# EAGLE design main_controller_board (EAGLE 7.5.0)

## Sheet 1 of 2
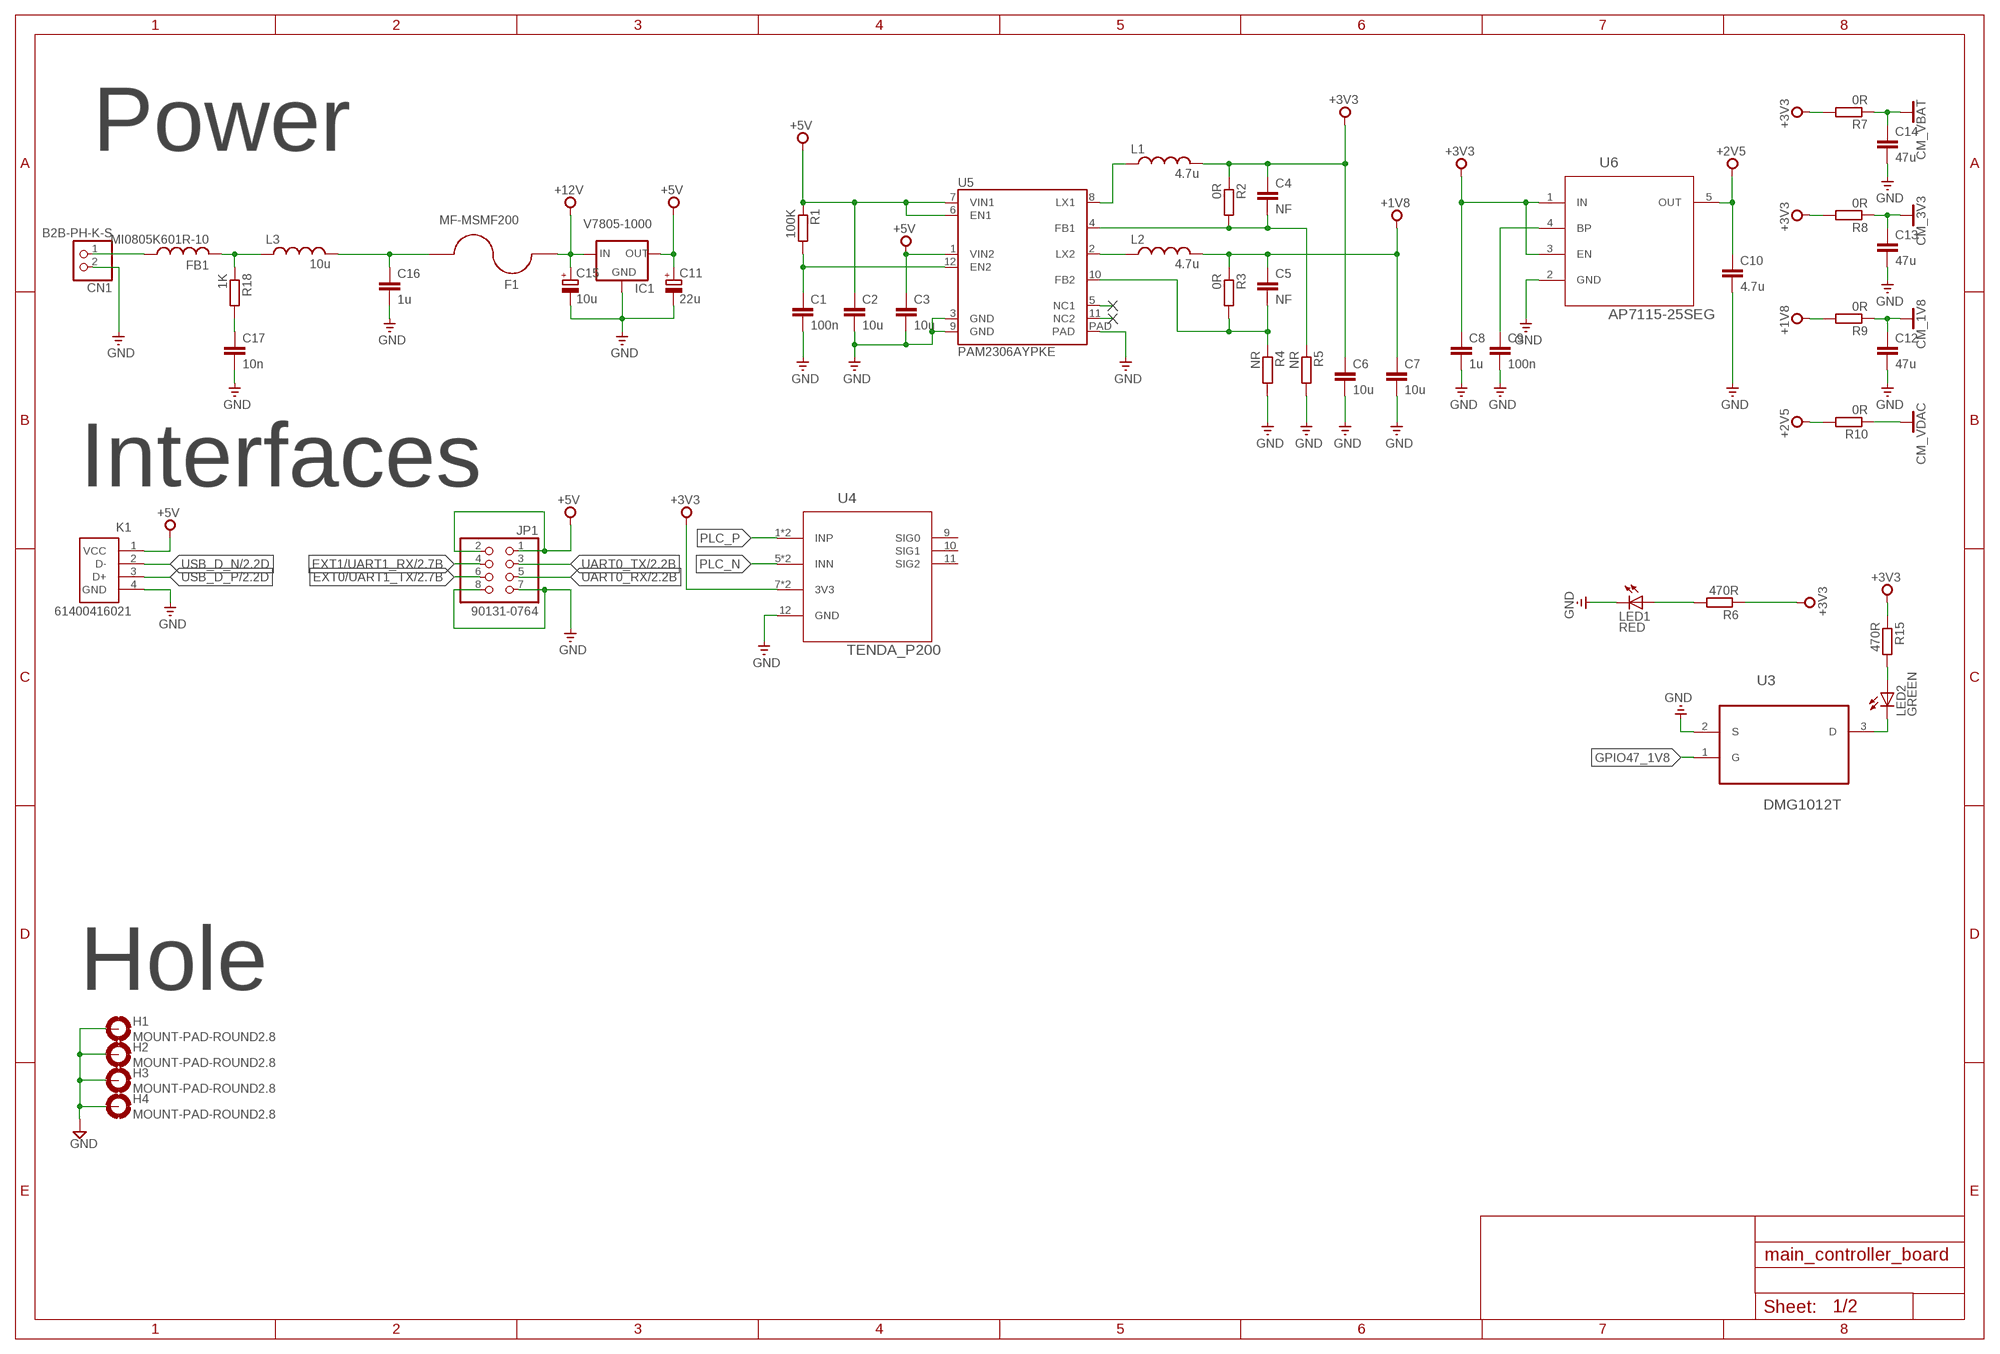
[diagram p0: schematic, sheet 1]

### Parts
C1  100n  C-EUC0402  [C0402]
C2  10u  C-EUC0805  [C0805]
C3  10u  C-EUC0805  [C0805]
C4  NF  C-EUC0402  [C0402]
C5  NF  C-EUC0402  [C0402]
C6  10u  C-EUC0805  [C0805]
C7  10u  C-EUC0805  [C0805]
C8  1u  C-EUC0402  [C0402]
C9  100n  C-EUC0402  [C0402]
C10  4.7u  C-EUC0603  [C0603]
C11  22u  CPOL-EU153CLV-0405  [153CLV-0405]
C12  47u  C-EUC1206  [C1206]
C13  47u  C-EUC1206  [C1206]
C14  47u  C-EUC1206  [C1206]
C15  10u  CPOL-EU153CLV-0405  [153CLV-0405]
C16  1u  C-EUC0402  [C0402]
C17  10n  C-EUC0402  [C0402]
CN1  B2B-PH-K-S  JST_2PIN-THM  [JST-PH-2-THM]
F1  MF-MSMF200  MF-MSMF075/24  [1812]
FB1  MI0805K601R-10  FERRITESIZE_0805  [R0805]
H1  MOUNT-PAD-ROUND2.8  [2,8-PAD]
H2  MOUNT-PAD-ROUND2.8  [2,8-PAD]
H3  MOUNT-PAD-ROUND2.8  [2,8-PAD]
H4  MOUNT-PAD-ROUND2.8  [2,8-PAD]
IC1  V7805-1000  VR_1OUTXX  [DIP_3PIN]
JP1  90131-0764  PINHD-2X4  [2X04]
K1  61400416021  [61400416021]
L1  4.7u  BOURNS-SRN4018  [BOURNS-SRN4018]
L2  4.7u  BOURNS-SRN4018  [BOURNS-SRN4018]
L3  10u  BOURNS-SRN4018  [BOURNS-SRN4018]
LED1  RED  LEDCHIP-LED0603  [CHIP-LED0603]
LED2  GREEN  LEDCHIP-LED0603  [CHIP-LED0603]
R1  100K  R-EU_R0402  [R0402]
R2  0R  R-EU_R0402  [R0402]
R3  0R  R-EU_R0402  [R0402]
R4  NR  R-EU_R0402  [R0402]
R5  NR  R-EU_R0402  [R0402]
R6  470R  R-EU_R0402  [R0402]
R7  0R  R-EU_R0805  [R0805]
R8  0R  R-EU_R0805  [R0805]
R9  0R  R-EU_R0805  [R0805]
R10  0R  R-EU_R0805  [R0805]
R15  470R  R-EU_R0402  [R0402]
R18  1K  R-EU_R0402  [R0402]
U3  DMG1012T  [SOT523]
U4  TENDA_P200  [TENDA_P200]
U5  PAM2306AYPKE  PAM2306  [WDFN3X3-12L]
U6  AP7115-25SEG  AP7115-XXSEG  [SOT353]

### Nets
+1V8: C5.1 C7.1 L2.P$1 R3.1 R9.2
+2V5: C10.1 R10.2 U6.5(OUT)
+3V3: C4.1 C6.1 C8.1 L1.P$1 R2.1 R6.1 R7.2 R8.2 R15.1 U4.7(3V3) U4.8(3V3) U6.1(IN) U6.3(EN) ; also sheet 2
+5V: C2.1 C3.1 C11.+ IC1.OUT JP1.1 JP1.2 K1.1(VCC) R1.1 U5.1(VIN2) U5.6(EN1) U5.7(VIN1)
+12V: C15.+ F1.2 IC1.IN
CM_1V8: C12.1 R9.1 ; also sheet 2
CM_3V3: C13.1 R8.1 ; also sheet 2
CM_VBAT: C14.1 R7.1 ; also sheet 2
CM_VDAC: R10.1 ; also sheet 2
EXT0/UART1_TX: JP1.6 ; also sheet 2
EXT1/UART1_RX: JP1.4 ; also sheet 2
GND [GND]: C1.2 C2.2 C3.2 C6.2 C7.2 C8.2 C9.2 C10.2 C11.- C12.2 C13.2 C14.2 C15.- C16.2 C17.2 CN1.2 H1.B2,8(MOUNT) H2.B2,8(MOUNT) H3.B2,8(MOUNT) H4.B2,8(MOUNT) IC1.GND JP1.7 JP1.8 K1.4(GND) LED1.C R4.2 R5.2 U3.2(S) U4.12(GND) U5.3(GND) U5.9(GND) U5.PAD U6.2(GND) ; also sheet 2
GPIO47_1V8: U3.1(G) ; also sheet 2
N$1: C1.1 R1.2 U5.12(EN2)
N$2: L1.P$2 U5.8(LX1)
N$3: U5.5(NC1)
N$4: U5.11(NC2)
N$5: C9.1 U6.4(BP)
N$6: FB1.2 L3.P$2 R18.1
N$7: L2.P$2 U5.2(LX2)
N$8: C4.2 R2.2 R5.1 U5.4(FB1)
N$9: LED1.A R6.2
N$10: C5.2 R3.2 R4.1 U5.10(FB2)
N$32: LED2.A R15.2
N$33: LED2.C U3.3(D)
N$36: CN1.1 FB1.1
N$37: C16.1 F1.1 L3.P$1
N$38: C17.1 R18.2
PLC_N [100ohm_differencial_pair]: U4.5(INN) U4.6(INN)
PLC_P [100ohm_differencial_pair]: U4.1(INP) U4.2(INP)
UART0_RX: JP1.5 ; also sheet 2
UART0_TX: JP1.3 ; also sheet 2
USB_D_N [90ohm_differencial_pair]: K1.2(D-) ; also sheet 2
USB_D_P [90ohm_differencial_pair]: K1.3(D+) ; also sheet 2
Unconnected: U4.9(SIG0) U4.10(SIG1) U4.11(SIG2)

### Notes on the sheet
- Power
- Interfaces
- Hole

## Sheet 2 of 2
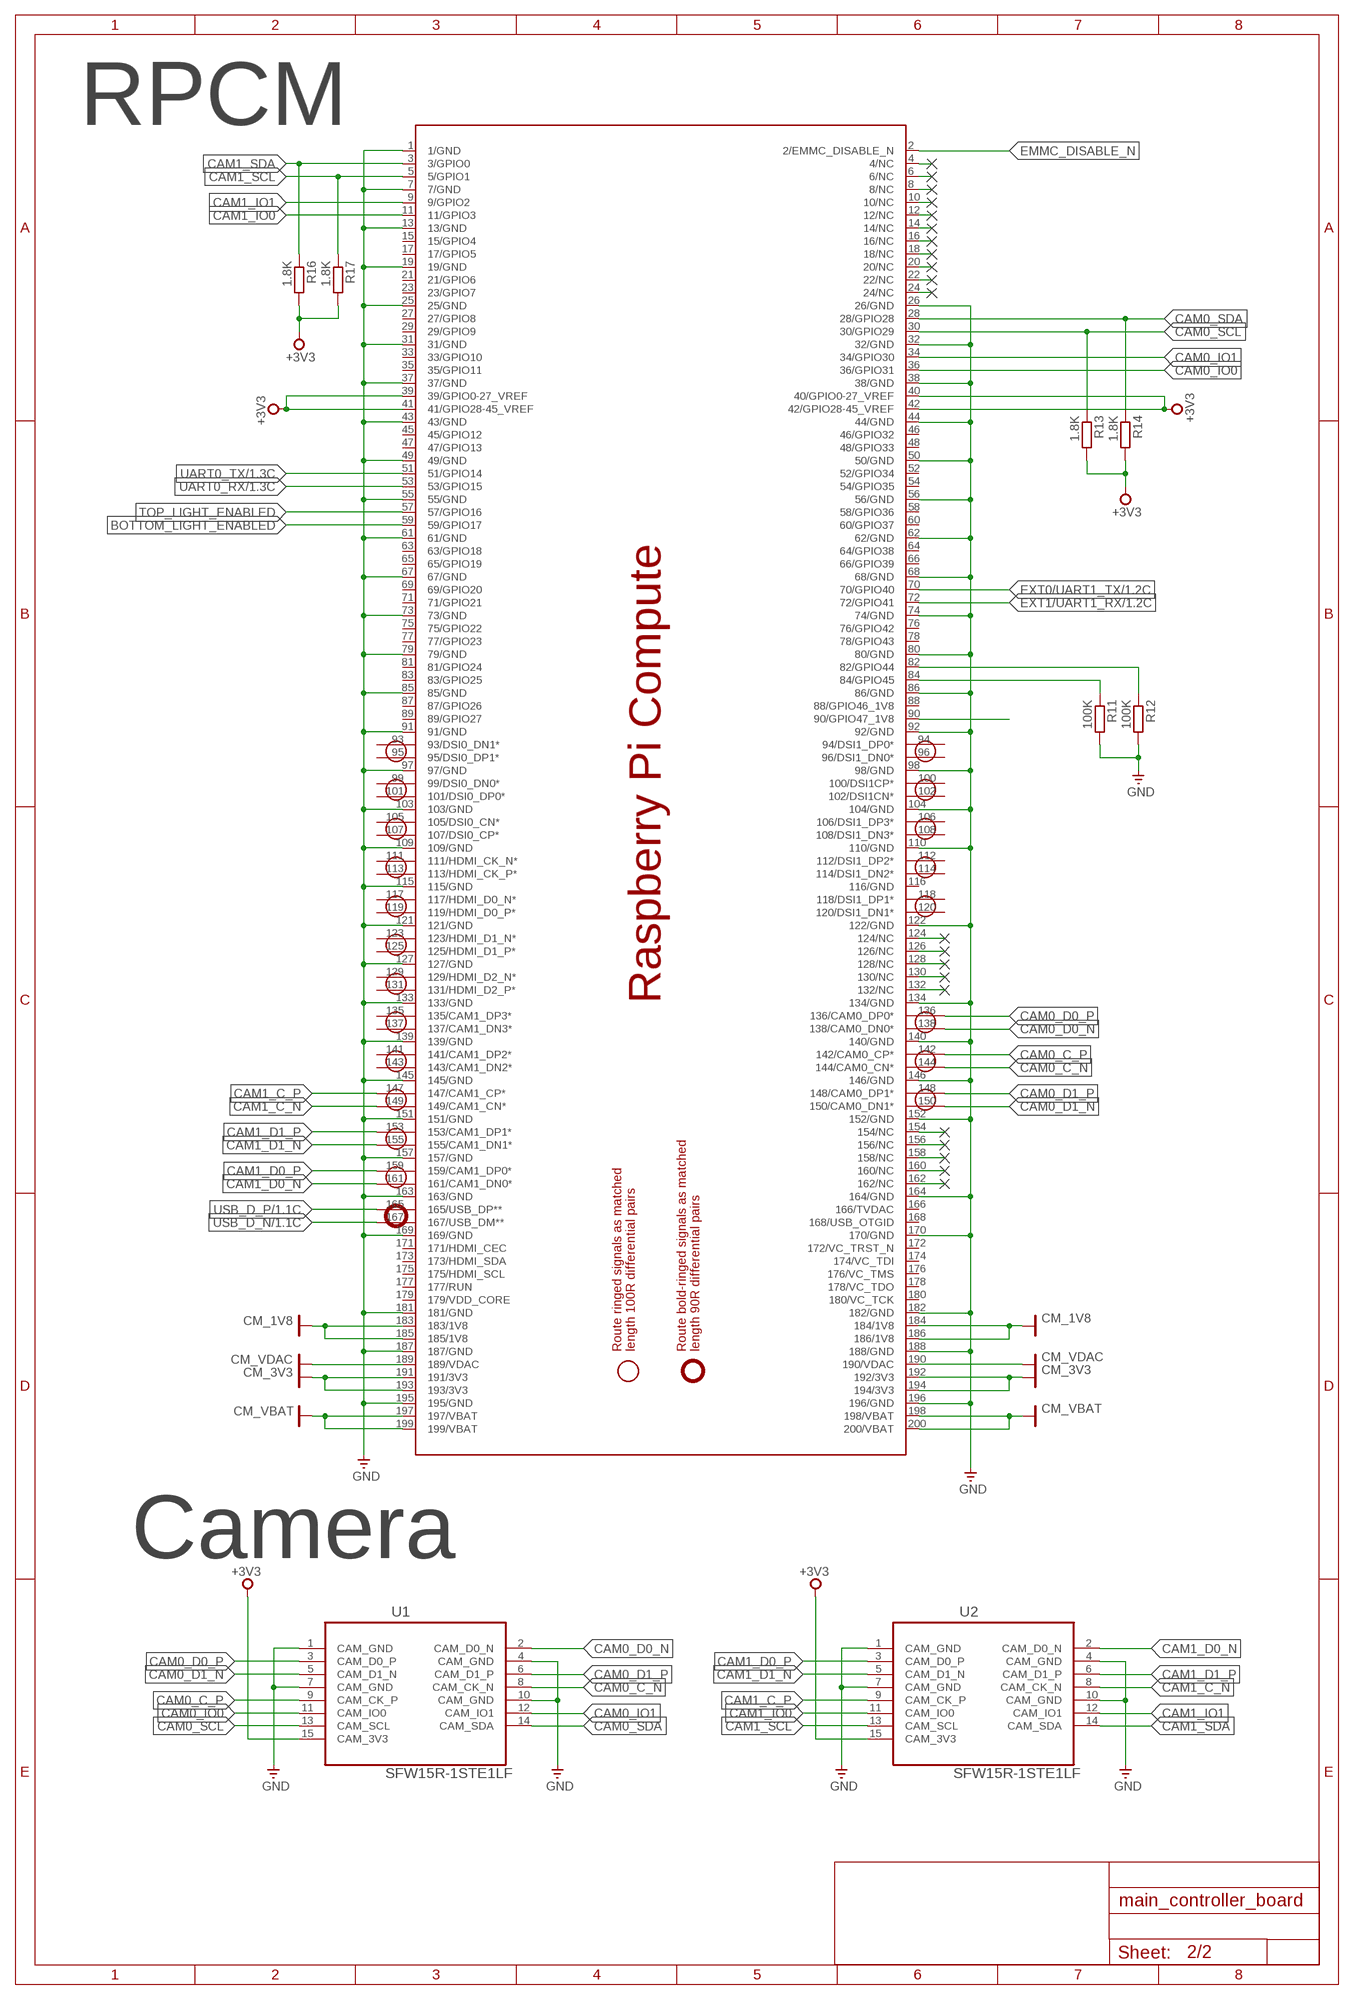
[diagram p1: schematic, sheet 2]

### Parts
PCB1  1473005-4  RPI_COMPUTE  [RPI_COMPUTE]
R11  100K  R-EU_R0402  [R0402]
R12  100K  R-EU_R0402  [R0402]
R13  1.8K  R-EU_R0402  [R0402]
R14  1.8K  R-EU_R0402  [R0402]
R16  1.8K  R-EU_R0402  [R0402]
R17  1.8K  R-EU_R0402  [R0402]
U1  SFW15R-1STE1LF  RPI_CAMERA  [RPI_CAMERA]
U2  SFW15R-1STE1LF  RPI_CAMERA  [RPI_CAMERA]

### Nets
+3V3: PCB1.39(39/GPIO0-27_VREF) PCB1.40(40/GPIO0-27_VREF) PCB1.41(41/GPIO28-45_VREF) PCB1.42(42/GPIO28-45_VREF) R13.2 R14.2 R16.2 R17.2 U1.15(CAM_3V3) U2.15(CAM_3V3) ; also sheet 1
BOTTOM_LIGHT_ENABLED: PCB1.59(59/GPIO17)
CAM0_C_N [100ohm_differencial_pair]: PCB1.144(144/CAM0_CN*) U1.8(CAM_CK_N)
CAM0_C_P [100ohm_differencial_pair]: PCB1.142(142/CAM0_CP*) U1.9(CAM_CK_P)
CAM0_D0_N [100ohm_differencial_pair]: PCB1.138(138/CAM0_DN0*) U1.2(CAM_D0_N)
CAM0_D0_P [100ohm_differencial_pair]: PCB1.136(136/CAM0_DP0*) U1.3(CAM_D0_P)
CAM0_D1_N [100ohm_differencial_pair]: PCB1.150(150/CAM0_DN1*) U1.5(CAM_D1_N)
CAM0_D1_P [100ohm_differencial_pair]: PCB1.148(148/CAM0_DP1*) U1.6(CAM_D1_P)
CAM0_IO0: PCB1.36(36/GPIO31) U1.11(CAM_IO0)
CAM0_IO1: PCB1.34(34/GPIO30) U1.12(CAM_IO1)
CAM0_SCL: PCB1.30(30/GPIO29) R13.1 U1.13(CAM_SCL)
CAM0_SDA: PCB1.28(28/GPIO28) R14.1 U1.14(CAM_SDA)
CAM1_C_N [100ohm_differencial_pair]: PCB1.149(149/CAM1_CN*) U2.8(CAM_CK_N)
CAM1_C_P [100ohm_differencial_pair]: PCB1.147(147/CAM1_CP*) U2.9(CAM_CK_P)
CAM1_D0_N [100ohm_differencial_pair]: PCB1.161(161/CAM1_DN0*) U2.2(CAM_D0_N)
CAM1_D0_P [100ohm_differencial_pair]: PCB1.159(159/CAM1_DP0*) U2.3(CAM_D0_P)
CAM1_D1_N [100ohm_differencial_pair]: PCB1.155(155/CAM1_DN1*) U2.5(CAM_D1_N)
CAM1_D1_P [100ohm_differencial_pair]: PCB1.153(153/CAM1_DP1*) U2.6(CAM_D1_P)
CAM1_IO0: PCB1.11(11/GPIO3) U2.11(CAM_IO0)
CAM1_IO1: PCB1.9(9/GPIO2) U2.12(CAM_IO1)
CAM1_SCL: PCB1.5(5/GPIO1) R17.1 U2.13(CAM_SCL)
CAM1_SDA: PCB1.3(3/GPIO0) R16.1 U2.14(CAM_SDA)
CM_1V8: PCB1.183(183/1V8) PCB1.184(184/1V8) PCB1.185(185/1V8) PCB1.186(186/1V8) ; also sheet 1
CM_3V3: PCB1.191(191/3V3) PCB1.192(192/3V3) PCB1.193(193/3V3) PCB1.194(194/3V3) ; also sheet 1
CM_VBAT: PCB1.197(197/VBAT) PCB1.198(198/VBAT) PCB1.199(199/VBAT) PCB1.200(200/VBAT) ; also sheet 1
CM_VDAC: PCB1.189(189/VDAC) PCB1.190(190/VDAC) ; also sheet 1
EMMC_DISABLE_N: PCB1.2(2/EMMC_DISABLE_N)
EXT0/UART1_TX: PCB1.70(70/GPIO40) ; also sheet 1
EXT1/UART1_RX: PCB1.72(72/GPIO41) ; also sheet 1
GND [GND]: PCB1.1(1/GND) PCB1.7(7/GND) PCB1.13(13/GND) PCB1.19(19/GND) PCB1.25(25/GND) PCB1.26(26/GND) PCB1.31(31/GND) PCB1.32(32/GND) PCB1.37(37/GND) PCB1.38(38/GND) PCB1.43(43/GND) PCB1.44(44/GND) PCB1.49(49/GND) PCB1.50(50/GND) PCB1.55(55/GND) PCB1.56(56/GND) PCB1.61(61/GND) PCB1.62(62/GND) PCB1.67(67/GND) PCB1.68(68/GND) PCB1.73(73/GND) PCB1.74(74/GND) PCB1.79(79/GND) PCB1.80(80/GND) PCB1.85(85/GND) PCB1.86(86/GND) PCB1.91(91/GND) PCB1.92(92/GND) PCB1.97(97/GND) PCB1.98(98/GND) PCB1.103(103/GND) PCB1.104(104/GND) PCB1.109(109/GND) PCB1.110(110/GND) PCB1.115(115/GND) PCB1.121(121/GND) PCB1.122(122/GND) PCB1.127(127/GND) PCB1.133(133/GND) PCB1.134(134/GND) PCB1.139(139/GND) PCB1.140(140/GND) PCB1.145(145/GND) PCB1.146(146/GND) PCB1.151(151/GND) PCB1.152(152/GND) PCB1.157(157/GND) PCB1.163(163/GND) PCB1.164(164/GND) PCB1.169(169/GND) PCB1.170(170/GND) PCB1.181(181/GND) PCB1.182(182/GND) PCB1.187(187/GND) PCB1.188(188/GND) PCB1.195(195/GND) PCB1.196(196/GND) R11.2 R12.2 U1.1(CAM_GND) U1.4(CAM_GND) U1.7(CAM_GND) U1.10(CAM_GND) U2.1(CAM_GND) U2.4(CAM_GND) U2.7(CAM_GND) U2.10(CAM_GND) ; also sheet 1
GPIO47_1V8: PCB1.90(90/GPIO47_1V8) ; also sheet 1
N$11: PCB1.154(154/NC)
N$12: PCB1.156(156/NC)
N$13: PCB1.158(158/NC)
N$14: PCB1.160(160/NC)
N$15: PCB1.162(162/NC)
N$16: PCB1.10(10/NC)
N$17: PCB1.12(12/NC)
N$18: PCB1.14(14/NC)
N$19: PCB1.16(16/NC)
N$20: PCB1.18(18/NC)
N$21: PCB1.20(20/NC)
N$22: PCB1.22(22/NC)
N$23: PCB1.24(24/NC)
N$24: PCB1.124(124/NC)
N$25: PCB1.126(126/NC)
N$26: PCB1.128(128/NC)
N$27: PCB1.130(130/NC)
N$28: PCB1.132(132/NC)
N$29: PCB1.4(4/NC)
N$30: PCB1.6(6/NC)
N$31: PCB1.82(82/GPIO44) R12.1
N$34: PCB1.84(84/GPIO45) R11.1
N$35: PCB1.8(8/NC)
TOP_LIGHT_ENABLED: PCB1.57(57/GPIO16)
UART0_RX: PCB1.53(53/GPIO15) ; also sheet 1
UART0_TX: PCB1.51(51/GPIO14) ; also sheet 1
USB_D_N [90ohm_differencial_pair]: PCB1.167(167/USB_DM**) ; also sheet 1
USB_D_P [90ohm_differencial_pair]: PCB1.165(165/USB_DP**) ; also sheet 1
Unconnected: PCB1.15(15/GPIO4) PCB1.17(17/GPIO5) PCB1.21(21/GPIO6) PCB1.23(23/GPIO7) PCB1.27(27/GPIO8) PCB1.29(29/GPIO9) PCB1.33(33/GPIO10) PCB1.35(35/GPIO11) PCB1.45(45/GPIO12) PCB1.46(46/GPIO32) PCB1.47(47/GPIO13) PCB1.48(48/GPIO33) PCB1.52(52/GPIO34) PCB1.54(54/GPIO35) PCB1.58(58/GPIO36) PCB1.60(60/GPIO37) PCB1.63(63/GPIO18) PCB1.64(64/GPIO38) PCB1.65(65/GPIO19) PCB1.66(66/GPIO39) PCB1.69(69/GPIO20) PCB1.71(71/GPIO21) PCB1.75(75/GPIO22) PCB1.76(76/GPIO42) PCB1.77(77/GPIO23) PCB1.78(78/GPIO43) PCB1.81(81/GPIO24) PCB1.83(83/GPIO25) PCB1.87(87/GPIO26) PCB1.88(88/GPIO46_1V8) PCB1.89(89/GPIO27) PCB1.93(93/DSI0_DN1*) PCB1.94(94/DSI1_DP0*) PCB1.95(95/DSI0_DP1*) PCB1.96(96/DSI1_DN0*) PCB1.99(99/DSI0_DN0*) PCB1.100(100/DSI1CP*) PCB1.101(101/DSI0_DP0*) PCB1.102(102/DSI1CN*) PCB1.105(105/DSI0_CN*) PCB1.106(106/DSI1_DP3*) PCB1.107(107/DSI0_CP*) PCB1.108(108/DSI1_DN3*) PCB1.111(111/HDMI_CK_N*) PCB1.112(112/DSI1_DP2*) PCB1.113(113/HDMI_CK_P*) PCB1.114(114/DSI1_DN2*) PCB1.116(116/GND) PCB1.117(117/HDMI_D0_N*) PCB1.118(118/DSI1_DP1*) PCB1.119(119/HDMI_D0_P*) PCB1.120(120/DSI1_DN1*) PCB1.123(123/HDMI_D1_N*) PCB1.125(125/HDMI_D1_P*) PCB1.129(129/HDMI_D2_N*) PCB1.131(131/HDMI_D2_P*) PCB1.135(135/CAM1_DP3*) PCB1.137(137/CAM1_DN3*) PCB1.141(141/CAM1_DP2*) PCB1.143(143/CAM1_DN2*) PCB1.166(166/TVDAC) PCB1.168(168/USB_OTGID) PCB1.171(171/HDMI_CEC) PCB1.172(172/VC_TRST_N) PCB1.173(173/HDMI_SDA) PCB1.174(174/VC_TDI) PCB1.175(175/HDMI_SCL) PCB1.176(176/VC_TMS) PCB1.177(177/RUN) PCB1.178(178/VC_TDO) PCB1.179(179/VDD_CORE) PCB1.180(180/VC_TCK)

### Notes on the sheet
- RPCM
- Camera

## Library data of the parts
C1-C10 C12-C14 C16 C17 = resistor:C-EU: CAPACITOR, European symbol
C11 C15 = resistor:CPOL-EU: POLARIZED CAPACITOR, European symbol
CN1 = openblw:JST_2PIN: JST 2-Pin Connectors of various flavors SMT-RA (S2B-PH-SM4) 4UConnector #17311 SMT (B2B-PH-SM4) THM-RA (S2B-PH) THM (B2B-PH)
F1 = openblw:MF-MSMF*?: PTC Resettable Fuse Documentation Datasheet <http://www.bourns.com/data/global/pdfs/mfmsmf.pdf> Features Compliant with AEC-Q200 Rev-C- Stress Test Qualification for Passive Components in Automotive Applications 100% electrically compatible with all previous generations of 1812 SMT devices Compatible with Pb and Pb-free solder reflow profiles RoHS compliant* and halogen free** Surface mount packaging for automated assembly Standard 4532 mm (1812 mils) footprint Patents pending; CATEGORY: Circuit Protection; CURRENT-MAX: 40A; CURRENT-TRIP: 1.5A; DESCRIPTION: PTC RESETTABLE .75A 24V 1812; DOCUMENTATION_LINK: <a href="http://www.bourns.com/data/global/pdfs/mfmsmf.pdf">Datasheet</a>; DOCUMENTATION_URL: http://www.bourns.com/data/global/pdfs/mfmsmf.pdf; FAMILY: PTC Resettable Fuses; MANUFACTURER: Bourns Inc.; PACKAGE: 1812 (4532 Metric), Concave; PART_NUMBER: MF-MSMF075/24-2; R_MINMAX: 0.11 ~ 0.450 Ohm; SERIES: MF-MSMF; SUPPLIER_ITEM_LINK: <a href="http://www.digikey.com/product-detail/en/MF-MSMF075%2F24-2/MF-MSMF075%2F24-2CT-ND/662844">Details</a>; SUPPLIER_ITEM_NUMBER: MF-MSMF075/24-2CT-ND; SUPPLIER_ITEM_URL: http://www.digikey.com/product-detail/en/MF-MSMF075%2F24-2/MF-MSMF075%2F24-2CT-ND/662844; SUPPLIER_LINK: <a href="http://www.digikey.com">Home Page</a>; SUPPLIER_NAME: Digi-Key; SUPPLIER_URL: http://www.digikey.com; TIME_TO_TRIP: 0.2s; VOLTAGE-MAX: 24V
FB1 = openblw:FERRITE: Generic Surface Mount Ferrite Chip
H1-H4 = holes:MOUNT-PAD-ROUND: MOUNTING PAD, round
IC1 = openblw:VR_1OUT: VOLTAGE REGULATOR
JP1 = pinhead:PINHD-2X4: PIN HEADER
K1 = openblw:61400416021: WR-COM Horizontal USB Type A
L1-L3 = openblw:BOURNS-SRN4018
LED1 LED2 = led:LED: LED OSRAM: - CHIPLED LG R971, LG N971, LY N971, LG Q971, LY Q971, LO R971, LY R971 LH N974, LH R974 LS Q976, LO Q976, LY Q976 LO Q996 - Hyper CHIPLED LW Q18S LB Q993, LB Q99A, LB R99A - SideLED LS A670, LO A670, LY A670, LG A670, LP A670 LB A673, LV A673, LT A673, LW A673 LH A674 LY A675 LS A676, LA A676, LO A676, LY A676, LW A676 LS A679, LY A679, LG A679 - Hyper Micro SIDELED® LS Y876, LA Y876, LO Y876, LY Y876 LT Y87S - SmartLED LW L88C, LW L88S LB L89C, LB L89S, LG L890 LS L89K, LO L89K, LY L89K LS L896, LA L896, LO L896, LY L896 - TOPLED LS T670, LO T670, LY T670, LG T670, LP T670 LSG T670, LSP T670, LSY T670, LOP T670, LYG T670 LG T671, LOG T671, LSG T671 LB T673, LV T673, LT T673, LW T673 LH T674 LS T676, LA T676, LO T676, LY T676, LB T676, LH T676, LSB T676, LW T676 LB T67C, LV T67C, LT T67C, LS T67K, LO T67K, LY T67K, LW E67C LS E67B, LA E67B, LO E67B, LY E67B, LB E67C, LV E67C, LT E67C LW T67C LS T679, LY T679, LG T679 LS T770, LO T770, LY T770, LG T770, LP T770 LB T773, LV T773, LT T773, LW T773 LH T774 LS E675, LA E675, LY E675, LS T675 LS T776, LA T776, LO T776, LY T776, LB T776 LHGB T686 LT T68C, LB T68C - Hyper Mini TOPLED® LB M676 - Mini TOPLED Santana® LG M470 LS M47K, LO M47K, LY M47K Source: http://www.osram.convergy.de LUXEON: - LUMILED® LXK2-PW12-R00, LXK2-PW12-S00, LXK2-PW14-U00, LXK2-PW14-V00 LXK2-PM12-R00, LXK2-PM12-S00, LXK2-PM14-U00 LXK2-PE12-Q00, LXK2-PE12-R00, LXK2-PE12-S00, LXK2-PE14-T00, LXK2-PE14-U00 LXK2-PB12-K00, LXK2-PB12-L00, LXK2-PB12-M00, LXK2-PB14-N00, LXK2-PB14-P00, LXK2-PB14-Q00 LXK2-PR12-L00, LXK2-PR12-M00, LXK2-PR14-Q00, LXK2-PR14-R00 LXK2-PD12-Q00, LXK2-PD12-R00, LXK2-PD12-S00 LXK2-PH12-R00, LXK2-PH12-S00 LXK2-PL12-P00, LXK2-PL12-Q00, LXK2-PL12-R00 Source: www.luxeon.com KINGBRIGHT: KA-3528ASYC Source: www.kingbright.com
PCB1 = openblw:RPI_COMPUTE: Device for a Raspberry PI Compute module. Note that the package is for a DDR2 connector of 'standard' orientation. Example: TE Connectivity P/N: 1565917-4, Newark P/N: 08P0616, Farnell P/N: 2112525 More information is available at http://www.element14.com/community/community/raspberry-pi/raspberry-pi-compute-module
R1-R18 = resistor:R-EU_: RESISTOR, European symbol
U1 U2 = openblw:RPI_CAMERA: FFC/FPC CONNECTOR, RECEPTACLE 16POS 1ROW; MPN: SFW16R-1STE1LF; OC_FARNELL: 1835594; OC_NEWARK: 62K5606; PACKAGE: CONNECTOR- 16POS; SUPPLIER: FCI
U3 = openblw:DMG1012T
U4 = openblw:TENDA_P200
U5 = openblw:PAM2306
U6 = openblw:AP7115-XX

## Net classes
1 GND: width 0.508 mm, drill 0.3 mm, clearance 0.15 mm to class 0, clearance 0.15 mm
2 100ohm_differencial_pair: width 0.254 mm, drill 0.3 mm, clearance 0.5 mm to class 0, clearance 0.5 mm to class 1, clearance 0.25 mm
3 90ohm_differencial_pair: width 0.254 mm, drill 0.3 mm, clearance 0.5 mm to class 0, clearance 0.5 mm to class 1, clearance 0.5 mm to class 2, clearance 0.15 mm
4 AGND: width 0.508 mm, drill 0.3 mm, clearance 0.5 mm to class 0, clearance 0.5 mm to class 1, clearance 0.5 mm to class 2, clearance 0.5 mm to class 3, clearance 0.15 mm

## Board
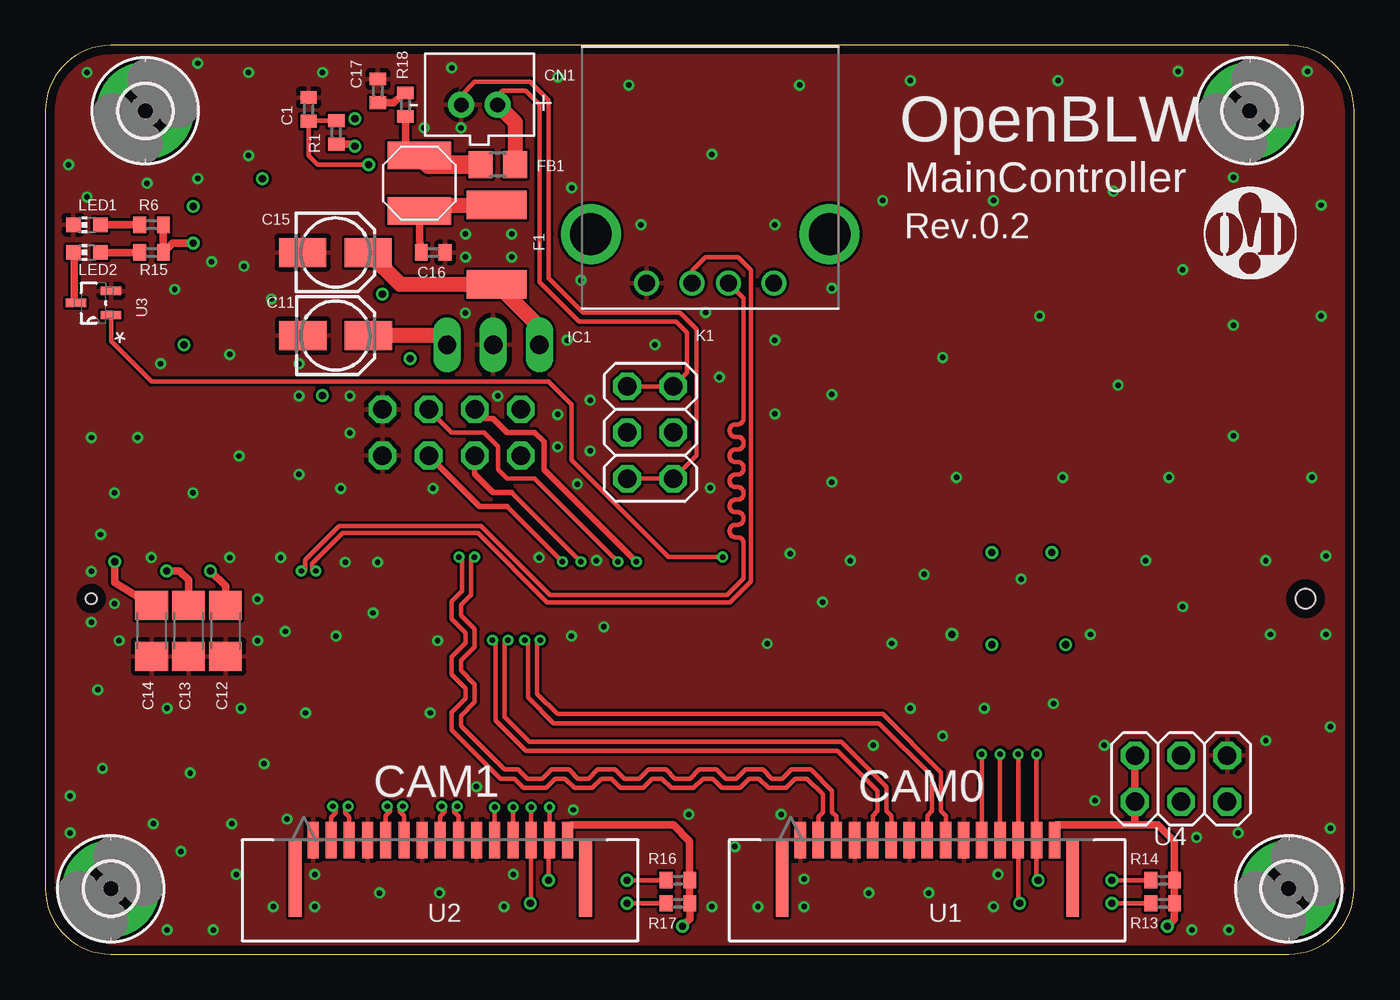
[diagram p2: board, top side]
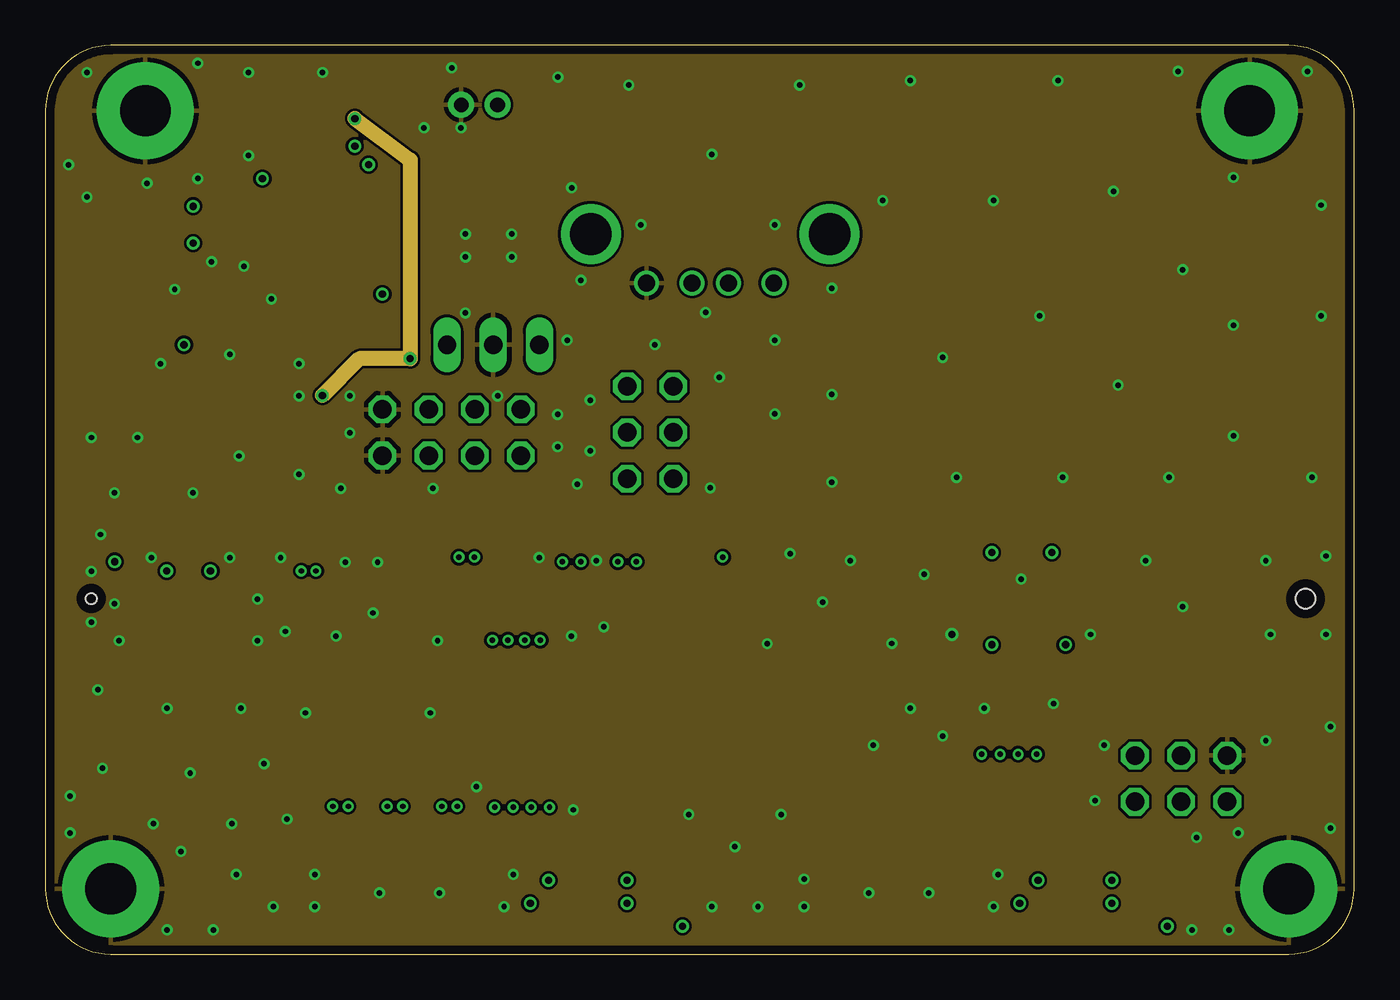
[diagram p3: board, inner layer Route2]
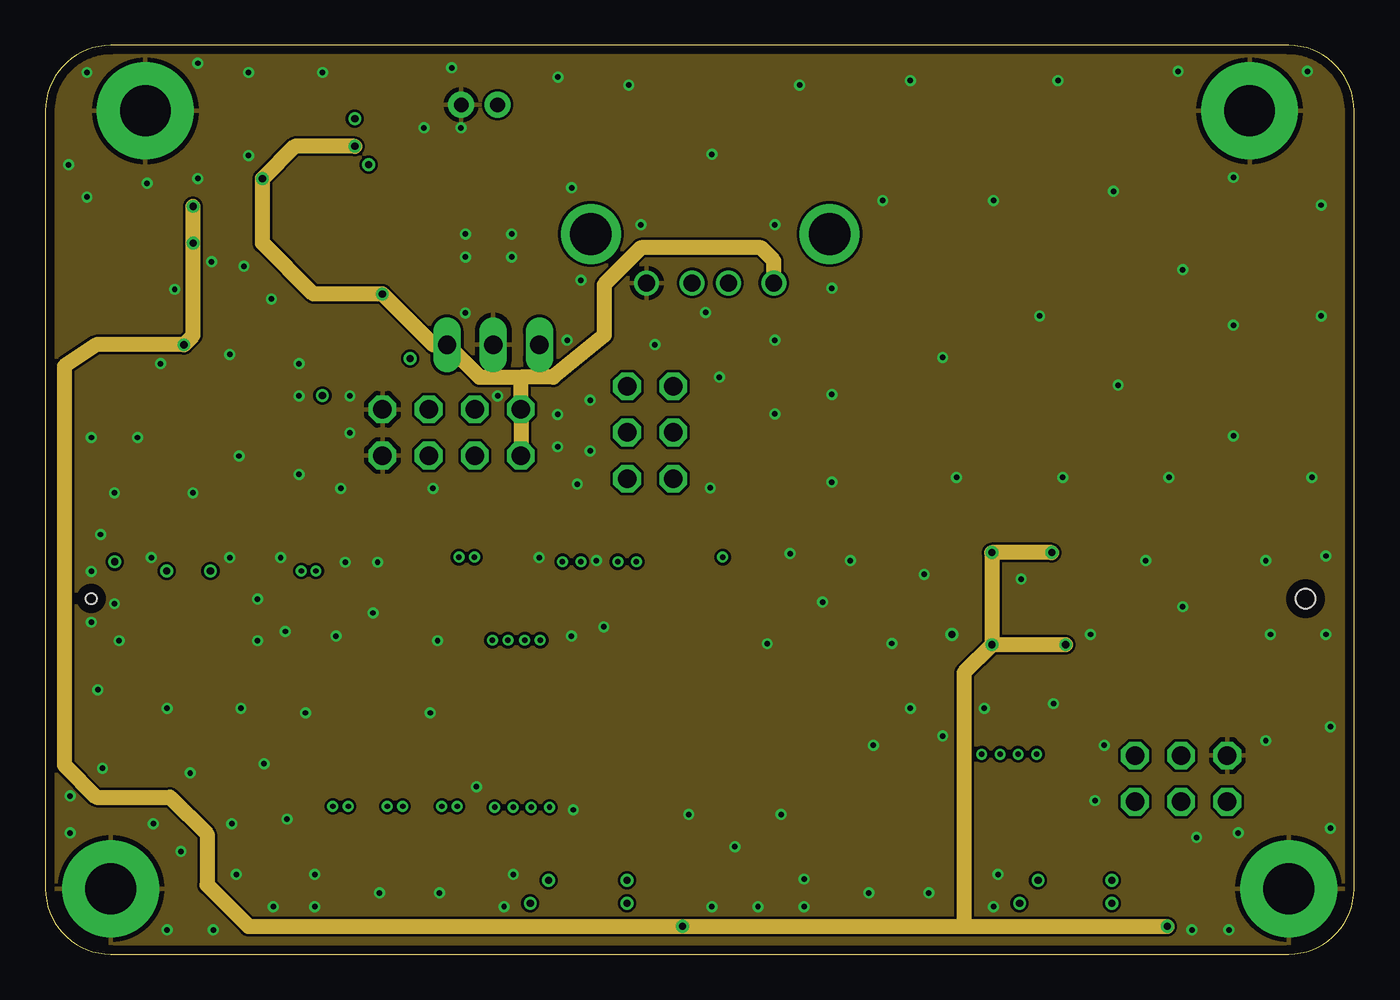
[diagram p4: board, inner layer Route15]
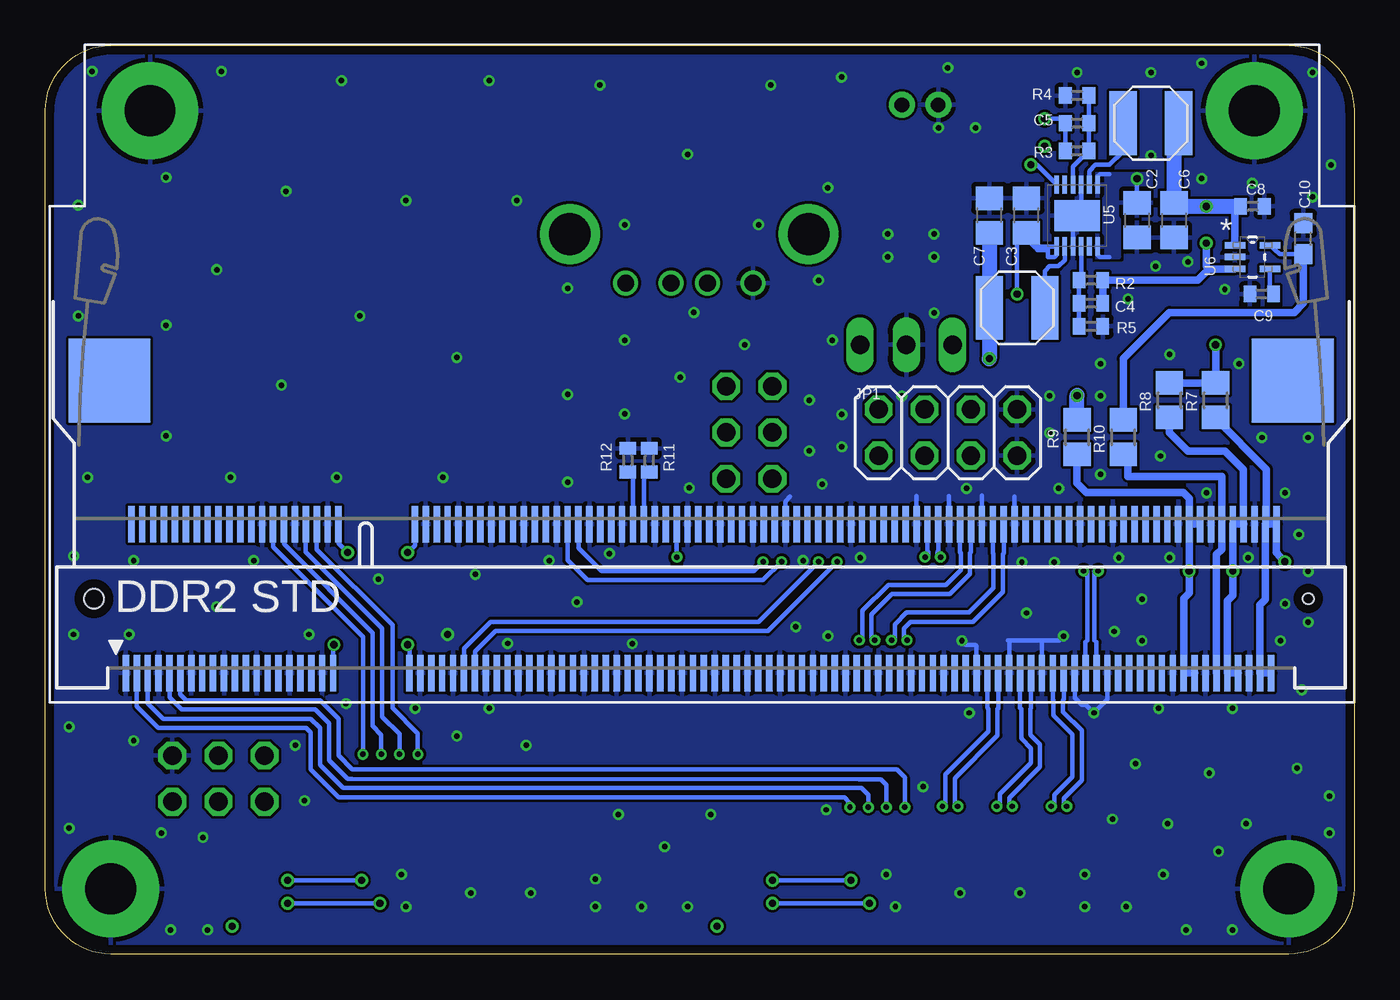
[diagram p5: board, bottom side, seen from below]

Size 72 x 50 mm. Coordinates in mm from the lower left corner, seen from the top.
Outline: 0,3.6 arc90 3.6,0 68.4,0 arc90 72,3.6 72,46.4 arc90 68.4,50 3.6,50 arc90 0,46.4 0,3.6
Copper layers (1+2*15+16): Top 0.018mm / dielectric 0.25mm / Route2 0.035mm / dielectric 1mm / Route15 0.035mm / dielectric 0.25mm / Bottom 0.018mm
Design rules "pban_5mil-l4 *": minimum track width 5mil, minimum drill 0.3mm, track to track 5mil, track to pad 5mil, pad to pad 5mil, via to via 5mil, smd to smd 5mil, copper to edge 0.5mm, drill to drill 0.5mm, minimum pad ring 0.15mm, minimum via ring 0.15mm, stop-mask expansion 4mil, vias tented up to drill 0.35mm, thermal gap 10mil

### Footprints (pad centres in the part's own frame; a part is rotated, then mirrored left to right if it is on the bottom)
C0402 = smd 0.7 x 0.9: 1 -0.65,0; 2 0.65,0
C0805 = smd 1.3 x 1.5: 1 -0.95,0; 2 0.95,0
C0603 = smd 1.1 x 1: 1 -0.85,0; 2 0.85,0
153CLV-0405 = smd 2.6 x 1.6: + 1.8,0; - -1.8,0
C1206 = smd 1.6 x 1.8: 1 -1.4,0; 2 1.4,0
JST-PH-2-THM = drill 0.8 pad 1.422: 1 1,0; 2 -1,0
1812 = smd 1.55 x 3.3: 1 -2.185,0; 2 2.185,0
R0805 = smd 1.3 x 1.5: 1 -0.95,0; 2 0.95,0
2,8-PAD = drill 2.8 pad 5.334: B2,8 0,0
DIP_3PIN = drill 1.016 long: GND 0,-2.54; IN -2.54,-2.54; OUT 2.54,-2.54
2X04 = drill 1.016 octagon: 1 -3.81,-1.27; 2 -3.81,1.27; 3 -1.27,-1.27; 4 -1.27,1.27; 5 1.27,-1.27; 6 1.27,1.27; 7 3.81,-1.27; 8 3.81,1.27
61400416021 = drill 0.92: 1 -3.5,2.7; 2 -1,2.7; 3 1,2.7; 4 3.5,2.7 | drill 2.3: 5 -6.57,0; 6 6.57,0
BOURNS-SRN4018 = smd 1.5 x 3.5: P$1 -1.525,0; P$2 1.525,0
CHIP-LED0603 = smd 0.8 x 0.8: A 0,-0.75; C 0,0.75
RPI_COMPUTE = smd 0.35 x 2: 1 -31.38,-4.1; 2 -31.08,4.1; 3 -30.78,-4.1; 4 -30.48,4.1; 5 -30.18,-4.1; 6 -29.88,4.1; 7 -29.58,-4.1; 8 -29.28,4.1; 9 -28.98,-4.1; 10 -28.68,4.1; 11 -28.38,-4.1; 12 -28.08,4.1; 13 -27.78,-4.1; 14 -27.48,4.1; 15 -27.18,-4.1; 16 -26.88,4.1; 17 -26.58,-4.1; 18 -26.28,4.1; 19 -25.98,-4.1; 20 -25.68,4.1; 21 -25.38,-4.1; 22 -25.08,4.1; 23 -24.78,-4.1; 24 -24.48,4.1; 25 -24.18,-4.1; 26 -23.88,4.1; 27 -23.58,-4.1; 28 -23.28,4.1; 29 -22.98,-4.1; 30 -22.68,4.1; 31 -22.38,-4.1; 32 -22.08,4.1; 33 -21.78,-4.1; 34 -21.48,4.1; 35 -21.18,-4.1; 36 -20.88,4.1; 37 -20.58,-4.1; 38 -20.28,4.1; 39 -19.98,-4.1; 40 -19.68,4.1; 41 -15.78,-4.1; 42 -15.48,4.1; 43 -15.18,-4.1; 44 -14.88,4.1; 45 -14.58,-4.1; 46 -14.28,4.1; 47 -13.98,-4.1; 48 -13.68,4.1; 49 -13.38,-4.1; 50 -13.08,4.1; 51 -12.78,-4.1; 52 -12.48,4.1; 53 -12.18,-4.1; 54 -11.88,4.1; 55 -11.58,-4.1; 56 -11.28,4.1; 57 -10.98,-4.1; 58 -10.68,4.1; 59 -10.38,-4.1; 60 -10.08,4.1; 61 -9.78,-4.1; 62 -9.48,4.1; 63 -9.18,-4.1; 64 -8.88,4.1; 65 -8.58,-4.1; 66 -8.28,4.1; 67 -7.98,-4.1; 68 -7.68,4.1; 69 -7.38,-4.1; 70 -7.08,4.1; 71 -6.78,-4.1; 72 -6.48,4.1; 73 -6.18,-4.1; 74 -5.88,4.1; 75 -5.58,-4.1; 76 -5.28,4.1; 77 -4.98,-4.1; 78 -4.68,4.1; 79 -4.38,-4.1; 80 -4.08,4.1; 81 -3.78,-4.1; 82 -3.48,4.1; 83 -3.18,-4.1; 84 -2.88,4.1; 85 -2.58,-4.1; 86 -2.28,4.1; 87 -1.98,-4.1; 88 -1.68,4.1; 89 -1.38,-4.1; 90 -1.08,4.1; 91 -0.78,-4.1; 92 -0.48,4.1; 93 -0.18,-4.1; 94 0.12,4.1; 95 0.42,-4.1; 96 0.72,4.1; 97 1.02,-4.1; 98 1.32,4.1; 99 1.62,-4.1; 100 1.92,4.1; 101 2.22,-4.1; 102 2.52,4.1; 103 2.82,-4.1; 104 3.12,4.1; 105 3.42,-4.1; 106 3.72,4.1; 107 4.02,-4.1; 108 4.32,4.1; 109 4.62,-4.1; 110 4.92,4.1; 111 5.22,-4.1; 112 5.52,4.1; 113 5.82,-4.1; 114 6.12,4.1; 115 6.42,-4.1; 116 6.72,4.1; 117 7.02,-4.1; 118 7.32,4.1; 119 7.62,-4.1; 120 7.92,4.1; 121 8.22,-4.1; 122 8.52,4.1; 123 8.82,-4.1; 124 9.12,4.1; 125 9.42,-4.1; 126 9.72,4.1; 127 10.02,-4.1; 128 10.32,4.1; 129 10.62,-4.1; 130 10.92,4.1; 131 11.22,-4.1; 132 11.52,4.1; 133 11.82,-4.1; 134 12.12,4.1; 135 12.42,-4.1; 136 12.72,4.1; 137 13.02,-4.1; 138 13.32,4.1; 139 13.62,-4.1; 140 13.92,4.1; 141 14.22,-4.1; 142 14.52,4.1; 143 14.82,-4.1; 144 15.12,4.1; 145 15.42,-4.1; 146 15.72,4.1; 147 16.02,-4.1; 148 16.32,4.1; 149 16.62,-4.1; 150 16.92,4.1; 151 17.22,-4.1; 152 17.52,4.1; 153 17.82,-4.1; 154 18.12,4.1; 155 18.42,-4.1; 156 18.72,4.1; 157 19.02,-4.1; 158 19.32,4.1; 159 19.62,-4.1; 160 19.92,4.1; 161 20.22,-4.1; 162 20.52,4.1; 163 20.82,-4.1; 164 21.12,4.1; 165 21.42,-4.1; 166 21.72,4.1; 167 22.02,-4.1; 168 22.32,4.1; 169 22.62,-4.1; 170 22.92,4.1; 171 23.22,-4.1; 172 23.52,4.1; 173 23.82,-4.1; 174 24.12,4.1; 175 24.42,-4.1; 176 24.72,4.1; 177 25.02,-4.1; 178 25.32,4.1; 179 25.62,-4.1; 180 25.92,4.1; 181 26.22,-4.1; 182 26.52,4.1; 183 26.82,-4.1; 184 27.12,4.1; 185 27.42,-4.1; 186 27.72,4.1; 187 28.02,-4.1; 188 28.32,4.1; 189 28.62,-4.1; 190 28.92,4.1; 191 29.22,-4.1; 192 29.52,4.1; 193 29.82,-4.1; 194 30.12,4.1; 195 30.42,-4.1; 196 30.72,4.1; 197 31.02,-4.1; 198 31.32,4.1; 199 31.62,-4.1; 200 31.92,4.1 | smd 4.5 x 4.6: M1 -32.28,12; M2 32.82,12 | hole 1.1: -33.13,0 | hole 0.6: 33.67,0
R0402 = smd 0.7 x 0.9: 1 -0.65,0; 2 0.65,0
RPI_CAMERA = smd 0.61 x 2.007: 1 6.985,2.743; 2 5.994,2.743; 3 5.004,2.743; 4 3.988,2.743; 5 2.997,2.743; 6 1.981,2.743; 7 0.991,2.743; 8 0,2.743; 9 -1.016,2.743; 10 -2.007,2.743; 11 -2.997,2.743; 12 -4.013,2.743; 13 -5.004,2.743; 14 -6.02,2.743; 15 -7.01,2.743 | smd 0.711 x 4.191: 17 -8.001,4.877; 18 7.976,4.877
SOT523 = smd 1.118 x 0.457: 1 -0.965,0.66; 2 -0.965,-0.66; 3 0.965,0
TENDA_P200 = drill 1.016 octagon: 1 1.27,1.27; 2 1.27,3.81; 3 3.81,1.27; 4 3.81,3.81; 5 6.35,1.27; 6 6.35,3.81; 7 24.13,29.21; 8 21.59,29.21; 9 24.13,31.75; 10 21.59,31.75; 11 24.13,34.29; 12 21.59,34.29
WDFN3X3-12L = smd 0.25 x 1: 1 -1.125,-1.7; 2 -0.675,-1.7; 3 -0.225,-1.7; 4 0.225,-1.7; 5 0.675,-1.7; 6 1.125,-1.7; 7 1.125,1.7; 8 0.675,1.7; 9 0.225,1.7; 10 -0.225,1.7; 11 -0.675,1.7; 12 -1.125,1.7 | smd 2.5 x 1.7: PAD 0,0
SOT353 = smd 1.118 x 0.356: 1 -0.965,0.65; 2 -0.965,0; 3 -0.965,-0.65; 4 0.965,-0.65; 5 0.965,0.65

### Placement (x,y rotation side)
C1  14.48,46.48 90 top
C2  11.94,40.39 270 bottom
C3  18.03,40.64 90 bottom
C4  14.48,35.81 180 bottom
C5  15.24,45.72 0 bottom
C6  9.91,40.39 270 bottom
C7  20.07,40.64 90 bottom
C8  5.59,41.15 0 bottom
C9  5.08,36.32 180 bottom
C10  2.79,39.37 90 bottom
C11  15.96,34.04 0 top
C12  9.91,17.78 270 top
C13  7.87,17.78 270 top
C14  5.84,17.78 270 top
C15  15.95,38.61 0 top
C16  21.34,38.61 0 top
C17  18.29,47.5 90 top
CN1  23.88,46.74 0 top
F1  24.82,39.04 270 top
FB1  24.89,43.43 180 top
H1  3.6,3.6 0 top
H2  68.4,3.6 0 top
H3  66.25,46.4 0 top
H4  5.5,46.4 0 top
IC1  24.64,30.99 180 top
JP1  22.35,28.7 0 bottom
K1  36.58,39.62 180 top
L1  11.18,45.72 180 bottom
L2  18.54,35.56 0 bottom
L3  20.57,42.42 90 top
LED1  2.29,40.13 90 top
LED2  2.29,38.61 90 top
LOGO1  [OHMYDIGIFAB_LOGO]  66.29,39.62 0 top
PCB1  36.2,19.56 0 bottom
R1  16,45.21 90 top
R2  14.48,37.08 180 bottom
R3  15.24,44.2 0 bottom
R4  15.24,47.24 180 bottom
R5  14.48,34.54 0 bottom
R6  5.84,40.13 180 top
R7  7.62,30.48 90 bottom
R8  10.16,30.48 90 bottom
R9  15.24,28.45 90 bottom
R10  12.7,28.45 90 bottom
R11  38.79,27.18 90 bottom
R12  39.95,27.18 90 bottom
R13  61.47,2.79 0 top
R14  61.47,4.06 0 top
R15  5.84,38.61 180 top
R16  34.8,4.06 0 top
R17  34.8,2.79 0 top
R18  19.81,46.74 90 top
U1  48.51,9.02 180 top
U2  21.72,9.02 180 top
U3  2.64,35.83 180 top
U4  30.73,32.51 270 top
U5  15.24,40.64 0 bottom
U6  5.59,38.35 0 bottom

### Tracks (layer width: path | path; a pad name or v marks a point on that pad's centre or on a via)
+1V8  (via drill 0.4)
  Route2 0.813: v15.24,30.73 17.27,32.77 v20.07,32.77 20.07,43.69 v17.02,45.97
  Bottom 0.254: R3.1 C5.1 16.14,45.97 v17.02,45.97
  Bottom 0.813: C7.1 L2.P$1 | L2.P$1 | R9.2 v15.24,30.73 | L2.P$1 v20.07,32.77
+2V5
  Bottom 0.254: U6.5 4.09,38.52 C10.1
  Bottom 0.406: R10.2 12.7,32.77 10.16,35.31 3.3,35.31 2.79,35.81 C10.1
+3V3  (via drill 0.4)
  Top 0.254: 28.96,7.11 28.73,6.88 U2.15 | 55.63,7.11 55.52,7.01 U1.15
  Top 0.406: R6.1 R15.1 7,39.12 v8.13,39.12 | 28.96,7.11 34.54,7.11 35.45,6.21 R16.2 R17.2 35.46,1.93 v35.05,1.52 | 59.94,7.11 61.21,7.11 62.12,6.21 R14.2 R13.2 62.12,1.92 v61.72,1.52 | 59.94,7.11 55.63,7.11 | 59.94,7.11 U4.7 U4.8
  Route15 0.813: v8.13,41.15 v8.13,39.12 8.13,34.04 v7.62,33.53 2.79,33.53 1.04,32.35 1.04,10.4 2.79,8.64 6.86,8.64 8.89,6.6 8.89,3.81 11.18,1.52 v35.05,1.52 50.55,1.52 | 50.55,1.52 v61.72,1.52 | v52.07,17.02 50.55,15.49 50.55,1.52 | v56.13,17.02 v52.07,17.02 | v55.37,22.1 v52.07,22.1 v52.07,17.02
  Bottom 0.254: U6.1 6.7,39.12 | 8.13,37.85 7.99,37.7 | PCB1.39 56.17,16.8 v56.13,17.02 | PCB1.41 51.98,16.92 v52.07,17.02 | PCB1.40 55.88,22.6 v55.37,22.1 | v52.07,22.1 51.67,22.49 PCB1.42
  Bottom 0.305: C8.1 6.35,41.15
  Bottom 0.406: C8.1 6.55,40.83 U6.1 | U6.3 7.99,37.7 8.6,37.1 8.89,37.08 R2.1 C4.1 | L1.P$1 9.91,45.72 | C6.1 9.59,41.15 | R8.2 R7.2 v7.62,33.53 | v8.13,39.12 8.13,37.85
  Bottom 0.813: 9.59,41.15 v8.13,41.15 6.35,41.15 | 9.91,45.72 C6.1
+5V  (via drill 0.4)
  Top 0.406: R1.1 16.88,44.56 v17.02,44.45
  Top 0.813: IC1.OUT 21.59,34.04 C11.+
  Route15 0.813: K1.1 40.08,38.16 39.37,38.86 32.77,38.86 30.73,36.83 30.73,34.04 27.94,31.75 26.16,31.75 | JP1.1 JP1.2 26.16,31.75 | 26.16,31.75 23.88,31.75 IC1.OUT 21.34,33.53 v18.54,36.32 14.73,36.32 11.94,39.12 v11.94,42.67 13.72,44.45 v17.02,44.45
  Bottom 0.254: U5.1 17.54,38.94 | 17.54,38.94 C3.1 18.54,39.12 v18.54,36.32 | C2.1 v11.94,42.67 | 13.46,38.35 13.99,38.35 14.12,38.48 | 13.46,42.93 13.99,42.93 14.12,42.8 | 16.85,38.88 16.85,38.75 | 16.85,38.75 16.85,38.35 16.48,38.35 16.37,38.47 | 16.85,38.75 17.41,38.75 17.54,38.87 | 17.54,38.87 17.78,39.12 | 17.54,38.87 17.54,38.94
  pour Bottom: 11.18,42.93 11.18,40.64 12.95,40.64 12.95,38.35 14.22,38.35 14.22,42.93
+12V
  Top 0.813: C15.+ 19.5,36.85 F1.2 27.18,34.49 IC1.IN
CAM0_C_N  (via drill 0.3)
  Top 0.254: U1.8 48.51,7.62 48.77,7.87 48.77,9.8 45.87,12.7 27.96,12.7 26.55,14.12 26.55,17.27 v26.37,17.27
  Bottom 0.254: v26.37,17.27 26.55,17.27 26.55,18.69 25.42,19.81 22.25,19.81 21.14,20.93 21.14,22.07 21.07,22.13 PCB1.144
CAM0_C_P  (via drill 0.3)
  Top 0.254: U1.9 49.53,7.62 49.27,7.87 49.27,10.01 46.08,13.21 28.17,13.21 27.05,14.33 27.05,17.27 v27.22,17.27
  Bottom 0.254: v27.22,17.27 27.05,17.27 27.05,18.9 25.63,20.32 22.46,20.32 21.64,21.14 21.64,22.07 21.68,22.11 PCB1.142
CAM0_D0_N  (via drill 0.3)
  Top 0.254: U1.2 42.52,7.54 42.78,7.8 42.78,8.79 41.91,9.65 41.25,9.65 40.74,9.15 39.77,9.15 39.27,9.65 38.71,9.65 38.2,9.15 37.23,9.15 36.73,9.65 36.17,9.65 35.66,9.15 34.44,9.15 33.93,9.65 33.38,9.65 32.87,9.15 31.65,9.15 31.14,9.65 30.58,9.65 30.08,9.15 29.11,9.15 28.6,9.65 28.04,9.65 27.54,9.15 26.31,9.15 25.8,9.65 25.04,9.65 22.35,12.34 22.35,13.31 23.12,14.07 23.12,14.63 22.35,15.39 22.35,16.36 23.12,17.12 23.12,17.68 22.35,18.44 22.35,19.41 22.93,19.98 22.93,21.84 v22.75,21.84
  Bottom 0.254: PCB1.138 22.88,22.17 22.93,22.12 22.93,21.84 v22.75,21.84
CAM0_D0_P  (via drill 0.3)
  Top 0.254: U1.3 43.51,7.57 43.28,7.8 43.28,8.99 42.12,10.16 41.04,10.16 40.54,9.65 39.98,9.65 39.47,10.16 38.5,10.16 38,9.65 37.44,9.65 36.93,10.16 35.96,10.16 35.46,9.65 34.65,9.65 34.14,10.16 33.17,10.16 32.66,9.65 31.85,9.65 31.35,10.16 30.38,10.16 29.87,9.65 29.31,9.65 28.81,10.16 27.84,10.16 27.33,9.65 26.52,9.65 26.01,10.16 25.25,10.16 22.86,12.55 22.86,13.1 23.62,13.87 23.62,14.84 22.86,15.6 22.86,16.15 23.62,16.91 23.62,17.88 22.86,18.65 22.86,19.2 23.43,19.77 23.43,21.84 v23.6,21.84
  Bottom 0.254: PCB1.136 23.48,22.17 23.43,22.12 23.43,21.84 v23.6,21.84
CAM0_D1_N  (via drill 0.3)
  Top 0.254: U1.5 45.52,7.62 45.77,7.87 45.77,8.99 43.58,11.18 26.44,11.18 24.77,12.85 24.77,17.27 v24.59,17.27
  Bottom 0.254: v24.59,17.27 24.77,17.27 24.77,17.93 24.41,18.29 20.98,18.29 19.33,19.94 19.33,22.02 19.27,22.08 PCB1.150
CAM0_D1_P  (via drill 0.3)
  Top 0.254: U1.6 46.53,7.62 46.28,7.87 46.28,9.2 43.79,11.68 26.65,11.68 25.27,13.06 25.27,17.27 v25.44,17.27
  Bottom 0.254: v25.44,17.27 25.27,17.27 25.27,18.14 24.61,18.79 21.19,18.79 19.84,20.14 19.84,22.02 19.88,22.06 PCB1.148
CAM0_IO0  (via drill 0.3)
  Top 0.254: U1.11 v51.51,11
  Bottom 0.254: PCB1.36 57.08,22.28 52.91,18.11 52.91,13.54 51.51,12.14 v51.51,11
CAM0_IO1  (via drill 0.3)
  Top 0.254: U1.12 v52.53,11
  Bottom 0.254: PCB1.34 57.67,22.11 53.47,17.91 53.47,13.06 52.53,12.12 v52.53,11
CAM0_SCL  (via drill 0.3, 0.4)
  Top 0.254: R13.1 v58.67,2.79 | v53.59,2.79 53.52,2.87 U1.13 v53.52,11
  Bottom 0.254: v58.67,2.79 v53.59,2.79 | PCB1.30 58.88,22.55 54,17.68 54,12.55 53.52,12.06 v53.52,11
CAM0_SDA  (via drill 0.3, 0.4)
  Top 0.254: R14.1 v58.67,4.06 | v54.61,4.06 54.53,4.14 U1.14 v54.53,11
  Bottom 0.254: v58.67,4.06 v54.61,4.06 | PCB1.28 59.48,22.39 54.53,17.45 v54.53,11
CAM1_C_N  (via drill 0.3)
  Top 0.254: U2.8 21.72,7.57 21.97,7.82 21.97,8.13 v21.8,8.13
  Bottom 0.254: v21.8,8.13 21.97,8.13 21.97,9.68 19.61,12.04 19.61,13.49 19.57,13.52 PCB1.149
CAM1_C_P  (via drill 0.3)
  Top 0.254: U2.9 22.73,7.57 22.48,7.82 22.48,8.13 v22.65,8.13
  Bottom 0.254: v22.65,8.13 22.48,8.13 22.48,9.88 20.11,12.25 20.11,13.49 20.18,13.55 PCB1.147
CAM1_D0_N  (via drill 0.3)
  Top 0.254: U2.2 15.72,7.52 15.98,7.77 15.98,8.13 v15.81,8.13
  Bottom 0.254: v15.81,8.13 15.98,8.13 15.98,8.56 14.99,9.55 14.99,12.3 16.03,13.34 16.03,13.97 15.97,14.02 PCB1.161
CAM1_D0_P  (via drill 0.3)
  Top 0.254: U2.3 16.71,7.54 16.48,7.77 16.48,8.13 v16.66,8.13
  Bottom 0.254: v16.66,8.13 16.48,8.13 16.48,8.77 15.49,9.76 15.49,12.09 16.53,13.13 16.53,13.97 16.57,14.01 PCB1.159
CAM1_D1_N  (via drill 0.3)
  Top 0.254: U2.5 18.72,7.59 18.98,7.85 18.98,8.13 v18.8,8.13
  Bottom 0.254: v18.8,8.13 18.98,8.13 18.98,8.61 17.27,10.31 17.27,11.53 17.81,12.07 17.81,13.49 17.77,13.52 PCB1.155
CAM1_D1_P  (via drill 0.3)
  Top 0.254: U2.6 19.74,7.59 19.48,7.85 19.48,8.13 v19.65,8.13
  Bottom 0.254: v19.65,8.13 19.48,8.13 19.48,8.82 17.78,10.52 17.78,11.33 18.31,11.86 18.31,13.49 18.38,13.55 PCB1.153
CAM1_IO0  (via drill 0.3)
  Top 0.254: 24.64,6.35 U2.11 v24.71,8.08
  Bottom 0.254: v24.71,8.08 24.71,9.73 25.15,10.16 55.12,10.16 55.88,10.92 55.88,12.95 56.9,13.97 64.26,13.97 64.58,14.28 PCB1.11
CAM1_IO1  (via drill 0.3)
  Top 0.254: v25.73,8.08 U2.12
  Bottom 0.254: v25.73,8.08 25.73,9.32 26.04,9.63 27.23,9.63 55.12,9.65 55.37,9.65 56.39,10.67 56.39,12.7 57.15,13.46 64.52,13.46 65.17,14.12 PCB1.9
CAM1_SCL  (via drill 0.3, 0.4)
  Top 0.254: U2.13 26.67,6.33 | R17.1 v32,2.79 | v26.67,2.79 26.72,2.59 U2.13 | v26.72,8.08 U2.13
  Bottom 0.254: v32,2.79 v26.67,2.79 | v26.72,8.08 26.72,8.76 27.1,9.14 55.63,9.14 56.9,10.41 56.9,12.45 57.4,12.95 65.53,12.95 66.38,13.8 PCB1.5
CAM1_SDA  (via drill 0.3, 0.4)
  Top 0.254: U2.14 27.69,6.33 | R16.1 v32,4.06 | v27.69,4.06 27.69,6.22 U2.14 | v27.74,8.08 U2.14
  Bottom 0.254: v32,4.06 v27.69,4.06 | v27.74,8.08 27.74,8.31 28.04,8.61 28.32,8.61 55.37,8.64 55.88,8.64 57.4,10.16 57.4,12.19 57.66,12.45 65.79,12.45 66.97,13.63 PCB1.3
CM_1V8  (via drill 0.4)
  Top 0.406: C12.1 9.91,19.24 9.91,20.25 v9.07,21.08
  Bottom 0.406: PCB1.185 PCB1.183 9.38,19.58 9.07,19.88 v9.07,21.08 PCB1.184 | R9.1 15.24,25.91 14.73,25.4 9.4,25.4 9.07,25.08 PCB1.184 | PCB1.184 PCB1.186
CM_3V3  (via drill 0.4)
  Top 0.406: 6.67,20.96 v6.67,21.08 7.37,21.08 7.87,20.57 C13.1
  Bottom 0.406: R8.1 10.16,28.7 9.14,27.69 7.11,27.69 6.1,26.67 6.1,23.68 | 6.1,23.68 PCB1.194 | 6.1,23.68 6.65,23.68 PCB1.192 v6.67,21.08 6.67,19.88 6.68,19.74 6.97,19.44 PCB1.191 PCB1.193
CM_VBAT  (via drill 0.4)
  Top 0.406: C14.1 3.81,20.45 v3.81,21.59
  Bottom 0.406: R7.1 7.62,29.46 4.83,26.67 4.83,23.71 PCB1.198 | PCB1.198 PCB1.200 4.28,22.1 v3.81,21.59 | PCB1.198 4.88,19.51 5.17,19.21 PCB1.197 PCB1.199
CM_VDAC
  Bottom 0.406: R10.1 12.45,27.5 12.45,26.29 7.28,26.29 PCB1.190 7.29,23.66 7.29,22.25 7.58,22 PCB1.189
EXT0/UART1_TX  (via drill 0.3)
  Top 0.254: JP1.6 22.35,28.7 24.13,28.7 24.89,27.94 24.89,26.67 25.4,26.16 26.92,26.16 v31.5,21.59
  Bottom 0.254: v31.5,21.59 32.51,20.57 42.16,20.57 43.27,21.68 PCB1.70
EXT1/UART1_RX  (via drill 0.3)
  Top 0.305: JP1.4 24.13,29.46 24.64,29.46 25.4,28.7 26.92,28.7 27.43,28.19 27.43,26.67 v32.51,21.59
  Bottom 0.254: v32.51,21.59 33.02,21.08 41.4,21.08 42.67,22.36 PCB1.72
GND  (via drill 0.3, 0.4)
  Bottom 0.254: U5.9 15.02,40.87 U5.PAD | 18.68,25.18 18.68,23.65 PCB1.152 | 24.07,25.21 24.07,23.66 PCB1.134 | 20.47,25.22 20.47,23.65 PCB1.146 | 22.29,25.2 22.29,23.66 PCB1.140 | PCB1.169 13.57,14.01 v14.31,13.27 14.76,13.72 14.99,13.72 15.38,14.11 PCB1.163 | PCB1.157 17.18,17.18 17.27,17.27 | 17.27,17.27 16.22,17.27 v15.99,17.5 | PCB1.151 18.98,17.2 19.05,17.27 17.27,17.27 | PCB1.145 20.77,16.96 20.83,17.02 21.35,17.02 v21.58,17.25 | 31.03,25.18 31.29,24.92 31.29,24.51 31.27,24.49 PCB1.110 | 15.47,40.07 15.46,39.25 U5.3 | U5.3
  other vias: 40.13,29.72 36.58,25.65 29.46,37.08 29.97,30.48 29.97,27.69 33.53,33.53 36.32,35.31 40.13,33.78 37.08,31.75 23.11,38.35 22.86,45.47 20.83,45.47 22.35,48.77 28.19,48.26 28.96,42.16 32.77,40.13 40.13,40.13 15.24,48.51 11.18,48.51 11.18,43.94 8.38,49.02 2.29,48.51 1.27,43.43 8.38,42.67 2.29,41.66 5.59,42.42 7.11,36.58 9.14,38.1 10.92,37.85 12.43,36.04 13.96,32.49 13.96,30.71 13.96,26.39 16.75,30.71 16.24,25.63 24.88,30.71 28.18,29.69 28.18,27.91 6.34,32.49 5.07,28.42 2.53,28.42 3.8,25.37 3.04,23.09 10.15,21.82 12.94,21.82 11.67,17.25 13.2,17.75 11.67,19.53 16.5,21.56 18.28,21.56 18.02,18.77 27.17,21.82 28.94,17.5 30.72,18.01 46.57,17.09 39.71,17.08 44.28,21.65 42.76,19.37 49.87,17.59 53.68,20.64 48.35,20.89 60.54,21.65 57.49,17.59 67.14,21.65 67.4,17.59 62.57,19.11 70.45,17.59 70.45,21.91 57.75,8.45 67.14,11.75 70.7,12.51 70.7,6.92 65.62,6.67 65.11,1.33 63.33,6.41 52.41,4.38 41.74,4.13 41.74,2.6 52.16,2.6 48.6,3.37 45.55,11.49 47.59,13.53 51.65,13.53 49.36,12 55.46,13.78 58.25,11.49 40.47,7.68 39.2,2.6 36.66,2.6 29.04,7.94 35.39,7.68 37.93,5.91 25.74,4.38 14.82,4.38 14.82,2.6 25.23,2.6 18.38,3.37 21.68,3.37 9.23,1.33 7.45,5.65 5.93,7.18 1.36,6.67 6.69,1.33 1.36,8.7 2.88,14.54 3.14,10.22 7.96,9.97 10.25,7.18 10.5,4.38 12.53,2.6 13.3,7.43 21.17,13.27 23.71,9.21 6.69,13.53 10.76,13.53 12.03,10.48 32.09,47.82 41.49,47.82 36.66,44.01 47.59,48.07 55.71,48.07 62.32,48.58 70.19,41.21 65.37,42.74 43.27,25.97 43.27,30.8 43.27,36.64 50.13,26.23 55.97,26.23 61.81,26.23 69.68,26.23 49.36,32.83 59.02,31.31 62.57,37.66 46.06,41.47 54.7,35.12 58.76,41.97 52.16,41.47 70.19,35.12 65.37,34.61 65.37,28.51 40.97,22.03 30.31,21.65 4.05,17.25 3.8,19.28 2.53,18.26 2.53,21.06 5.83,21.82 8.12,25.37 45.3,3.37 63.08,1.33 29.26,25.86 23.1,35.28 10.15,32.99 10.66,27.41 16.75,28.68 21.32,25.63 69.43,48.58 28.7,33.78 25.65,39.62 25.65,38.35 23.11,39.62
  pour Top (rank 6): 72,50 72,0 0,0 0,50
  pour Bottom (rank 6): 0.01,50 0.01,0 72.01,0 72,50
  pour Route15 (rank 6): 0.01,50 0.01,0 72.01,0 72,50
  pour Route2 (rank 6): 0.01,50 0.01,0 72.01,0 72,50
GPIO47_1V8  (via drill 0.3)
  Top 0.254: v37.26,21.84 34.29,21.84 28.96,27.18 28.96,30.23 27.69,31.5 5.84,31.5 3.61,33.73 U3.1
  Bottom 0.254: v37.26,21.84 37.27,21.86 PCB1.90
N$1  (via drill 0.4)
  Top 0.254: 15.89,45.72 R1.2 14.19,45.86 C1.1 14.48,43.94 14.99,43.43 v17.78,43.43
  Bottom 0.254: v17.78,43.43 17.46,43.43 U5.12
N$2
  Bottom 0.254: L1.P$2 12.7,44.2 13.46,43.43 14.22,43.43 14.56,43.09 U5.8
N$5
  Bottom 0.254: C9.1 4.62,36.64 U6.4
N$6
  Top 0.406: L3.P$2 19.81,44.45 R18.1
  Top 1.016: FB1.2 21.08,43.43 L3.P$2
N$7
  Bottom 0.254: L2.P$2 17.02,37.59 16.76,37.85 16.26,37.85 15.91,38.19 U5.2
N$8
  Bottom 0.254: R5.1 C4.2 R2.2 15.02,37.2 U5.4
N$9
  Top 0.406: R6.2 LED1.A
N$10
  Bottom 0.254: R4.1 C5.2 R3.2 15.46,43.32 U5.10
N$31
  Bottom 0.254: PCB1.82 39.67,26.32 R12.1
N$32
  Top 0.406: R15.2 LED2.A
N$33
  Top 0.406: LED2.C 1.57,38.35 1.57,36.07 U3.3
N$34
  Bottom 0.254: PCB1.84 39.08,26.24 R11.1
N$36
  Top 0.813: CN1.1 25.84,45.77 FB1.1
N$37
  Top 0.406: C16.1 20.57,39.26 L3.P$1
  Top 0.813: L3.P$1 21.16,41.23 F1.1
N$38
  Top 0.406: R18.2 19.3,46.99 19.16,46.85 C17.1 18.29,46.99
PLC_N
  Top 0.254: 22.86,46.74 22.86,47.24 23.62,48.01 26.67,48.01 27.69,46.99 27.69,39.63 27.68,39.62 27.68,37.19 29.57,35.3 34.9,35.3 35.81,34.39 35.81,27.43 U4.6 U4.5
PLC_P
  Top 0.254: 24.89,46.74 24.89,47.24 25.15,47.5 26.42,47.5 27.18,46.74 27.18,36.98 29.36,34.8 34.69,34.8 35.31,34.19 35.31,32 U4.2 U4.1
UART0_RX  (via drill 0.3)
  Top 0.254: 25.4,24.64 v28.45,21.59
  Top 0.305: JP1.5 23.88,24.64 25.4,24.64
  Bottom 0.254: v28.45,21.59 32.26,17.78 47.24,17.78 48.38,16.65 PCB1.53
UART0_TX  (via drill 0.3)
  Top 0.254: 25.65,25.4 v29.46,21.59
  Top 0.305: JP1.3 23.62,26.42 24.64,25.4 25.65,25.4
  Bottom 0.254: v29.46,21.59 32.77,18.29 47.5,18.29 48.98,16.81 PCB1.51
USB_D_N  (via drill 0.3)
  Top 0.254: v14.08,21.08 14.28,21.08 14.28,21.67 16.17,23.57 23.96,23.57 27.77,19.76 37.51,19.76 38.41,20.66 38.41,22.62 arc90 38.09,22.93 37.96,22.93 arc-90 37.65,23.25 37.65,23.31 arc-90 37.96,23.62 38.09,23.62 arc90 38.41,23.94 38.41,24 arc90 38.09,24.31 37.96,24.31 arc-90 37.65,24.63 37.65,24.69 arc-90 37.96,25 38.09,25 arc90 38.41,25.32 38.41,25.38 arc90 38.09,25.7 37.96,25.7 arc-90 37.65,26.01 37.65,26.07 arc-90 37.96,26.39 38.09,26.39 arc90 38.41,26.7 38.41,26.76 arc90 38.09,27.08 37.96,27.08 arc-90 37.65,27.39 37.65,27.45 arc-90 37.96,27.77 38.09,27.77 arc90 38.41,28.08 38.41,28.14 arc90 38.09,28.46 37.96,28.46 arc-90 37.65,28.77 37.65,28.84 arc-90 37.96,29.15 38.09,29.15 arc90 38.41,29.46 38.41,36.09 K1.2
  Bottom 0.254: PCB1.167 14.18,17.17 14.28,17.27 14.28,21.08 v14.08,21.08
USB_D_P  (via drill 0.3)
  Top 0.254: v14.88,21.08 14.68,21.08 14.68,21.51 16.34,23.17 23.79,23.17 27.6,19.36 37.68,19.36 38.81,20.49 38.81,37.64 38.1,38.35 36.32,38.35 35.58,37.61 K1.3
  Bottom 0.254: PCB1.165 14.78,17.18 14.68,17.27 14.68,21.08 v14.88,21.08

### Text on the board
tPlace: OpenBLW | MainController | Rev.0.2 | CAM1 | CAM0